# EAGLE design OpenROV Topside Interface 2.6A (EAGLE 6.4)
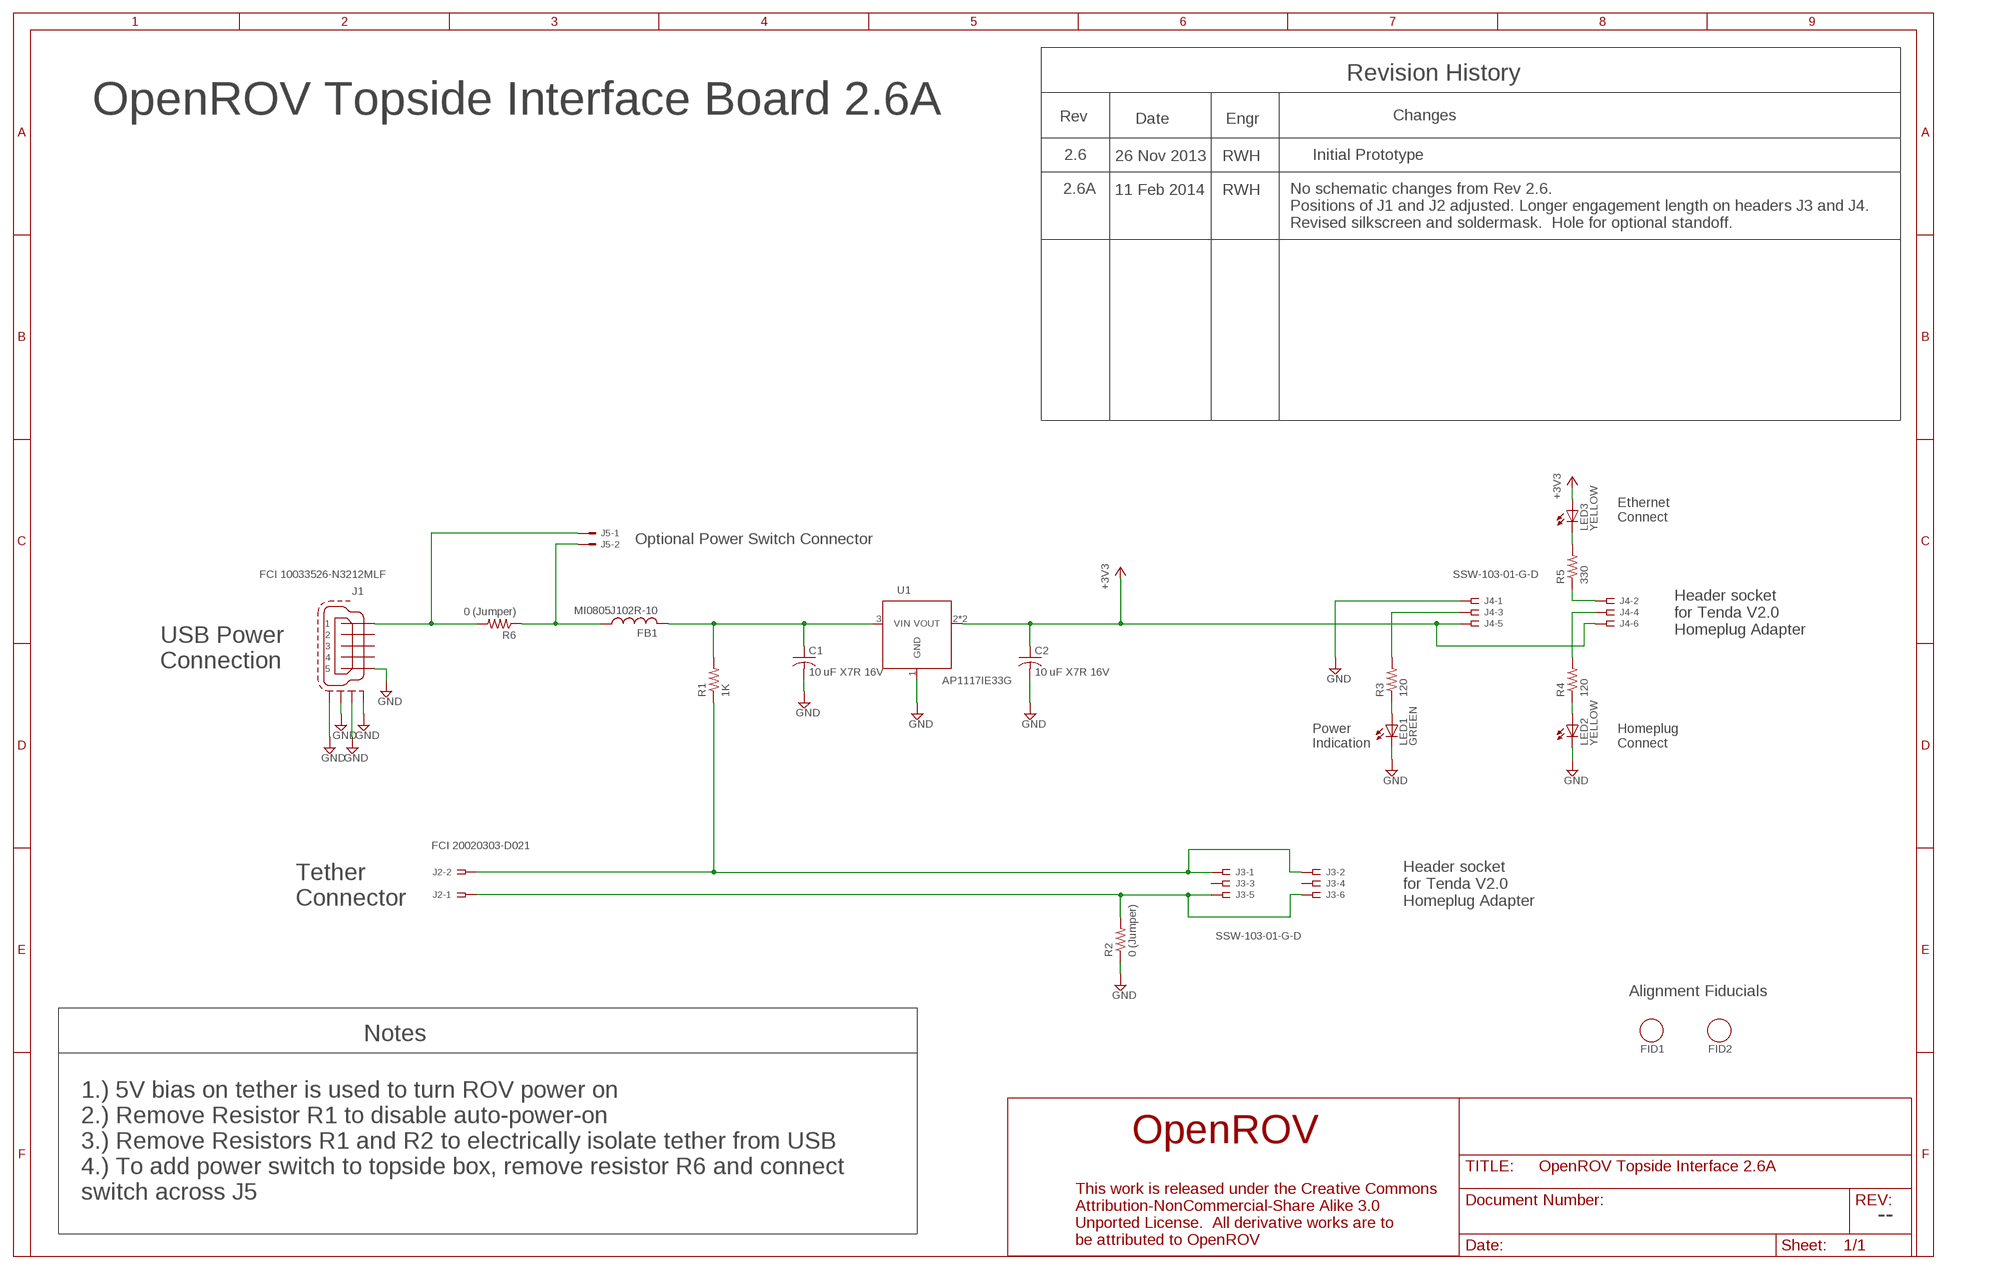
[diagram p0: schematic, sheet 1]

## Parts
C1  10 uF X7R 16V  CAP1206  [R1206]
C2  10 uF X7R 16V  CAP1206  [R1206]
FB1  MI0805J102R-10  FERRITESIZE_0805  [R0805]
FID1  FIDUCIAL_1  [FIDUCIAL_1]
FID2  FIDUCIAL_1  [FIDUCIAL_1]
J1  FCI 10033526-N3212MLF  USB_MINI-BSURFACE_MOUNT  [USB_MINI-B_SM]
J2  FCI 20020303-D021  FCI_TERMINAL_BLOCK_2PL  [FCI_09-381_2PL]
J3  SSW-103-01-G-D  HDR_SOCKET_2X3  [SSW-103-02-S-D]
J4  SSW-103-01-G-D  HDR_SOCKET_2X3  [SSW-103-02-S-D]
J5  HDR_1X2X0.100-ALT_SILK  [22-23-2021_ALT_SILK]
LED1  GREEN  LED-0805_BOTTOM_MT  [LED_0805_BOTTOM_MT(OSRAM)]
LED2  YELLOW  LED-0805_BOTTOM_MT  [LED_0805_BOTTOM_MT(OSRAM)]
LED3  YELLOW  LED-0805_BOTTOM_MT  [LED_0805_BOTTOM_MT(OSRAM)]
R1  1K  RESISTOR-0805  [R0805]
R2  0 (Jumper)  RESISTOR-0805  [R0805]
R3  120  RESISTOR-0805  [R0805]
R4  120  RESISTOR-0805  [R0805]
R5  330  RESISTOR-0805  [R0805]
R6  0 (Jumper)  RESISTOR-0805  [R0805]
U1  AP1117IE33G  AP1117SOT223  [SOT223]

## Nets
+3V3: C2.1 J4.5 J4.6 LED3.A U1.2(VOUT) U1.4(VOUT)
GND: C1.2 C2.2 J1.5 J1.M1(S1) J1.M2(S2) J1.M3(S3) J1.M4(S4) J4.1 LED1.C LED2.C R2.1 U1.1(GND)
N$1: J2.1A J2.1B J3.5 J3.6 R2.2
N$2: J2.2A J2.2B J3.1 J3.2 R1.1
N$3: J1.1 J5.1 R6.2
N$4: C1.1 FB1.2 R1.2 U1.3(VIN)
N$5: LED3.C R5.2
N$6: J4.3 R3.2
N$7: LED1.A R3.1
N$8: LED2.A R4.1
N$9: J4.4 R4.2
N$10: FB1.1 J5.2 R6.1
N$11: J4.2 R5.1
Unconnected: J1.2 J1.3 J1.4 J3.3 J3.4

## Notes on the sheet
- Revision History
- OpenROV Topside Interface Board 2.6A
- Rev | Date | Engr | Changes
- 2.6 | 26 Nov 2013 | RWH | Initial Prototype
- 2.6A | 11 Feb 2014 | RWH
- No schematic changes from Rev 2.6.
  Positions of J1 and J2 adjusted. Longer engagement length on headers J3 and J4.
  Revised silkscreen and soldermask.  Hole for optional standoff.
- Ethernet
  Connect
- Optional Power Switch Connector
- Header socket
  for Tenda V2.0
  Homeplug Adapter
- USB Power
  Connection
- Power
  Indication
- Homeplug
  Connect
- Tether
  Connector
- Header socket
  for Tenda V2.0
  Homeplug Adapter
- Alignment Fiducials
- Notes
- 1.) 5V bias on tether is used to turn ROV power on
  2.) Remove Resistor R1 to disable auto-power-on
  3.) Remove Resistors R1 and R2 to electrically isolate tether from USB
  4.) To add power switch to topside box, remove resistor R6 and connect
  switch across J5
- --

## Library data of the parts
C1 C2 = Walts_Generic_Parts:CAP: Generic Non-Polarized Capacitor
FB1 = Walts_Generic_Parts:FERRITE: Generic Surface Mount Ferrite Chip
FID1 FID2 = Walts Test Points and Pads:FIDUCIAL_1: Alignment Fiducial
J1 = OpenROV Topside Interface:USB_MINI-B: MINI USB-B Conector Adapted from Eagle Cypress connector library; OC_FARNELL: unknown; OC_NEWARK: unknown
J2 = OpenROV Topside Interface:FCI_TERMINAL_BLOCK_2PL: FCI 2-place Terminal Block 09-381 / 20020303
J3 J4 = OpenROV Topside Interface:HDR_SOCKET_2X3: 2X3 THROUGH-HOLE .025" SQ POST SOCKET Based upon Samtec SSW-103-02-S-D; MPN: SSW-103-02-S-D; OC_FARNELL: unknown; OC_NEWARK: 11P9365
J5 = Walts Generic Connectors:HDR_1X2X0.100: .100" (2.54mm) Center Header - 2 Pin Derived from Molex 22-23-2021
LED1-LED3 = Walts_Generic_Parts:LED: Generic LED
R1-R6 = Walts_Generic_Parts:RESISTOR: Generic Resistor
U1 = OpenROV Topside Interface:AP1117: Diodes, Inc. Voltage Regulator

## Board
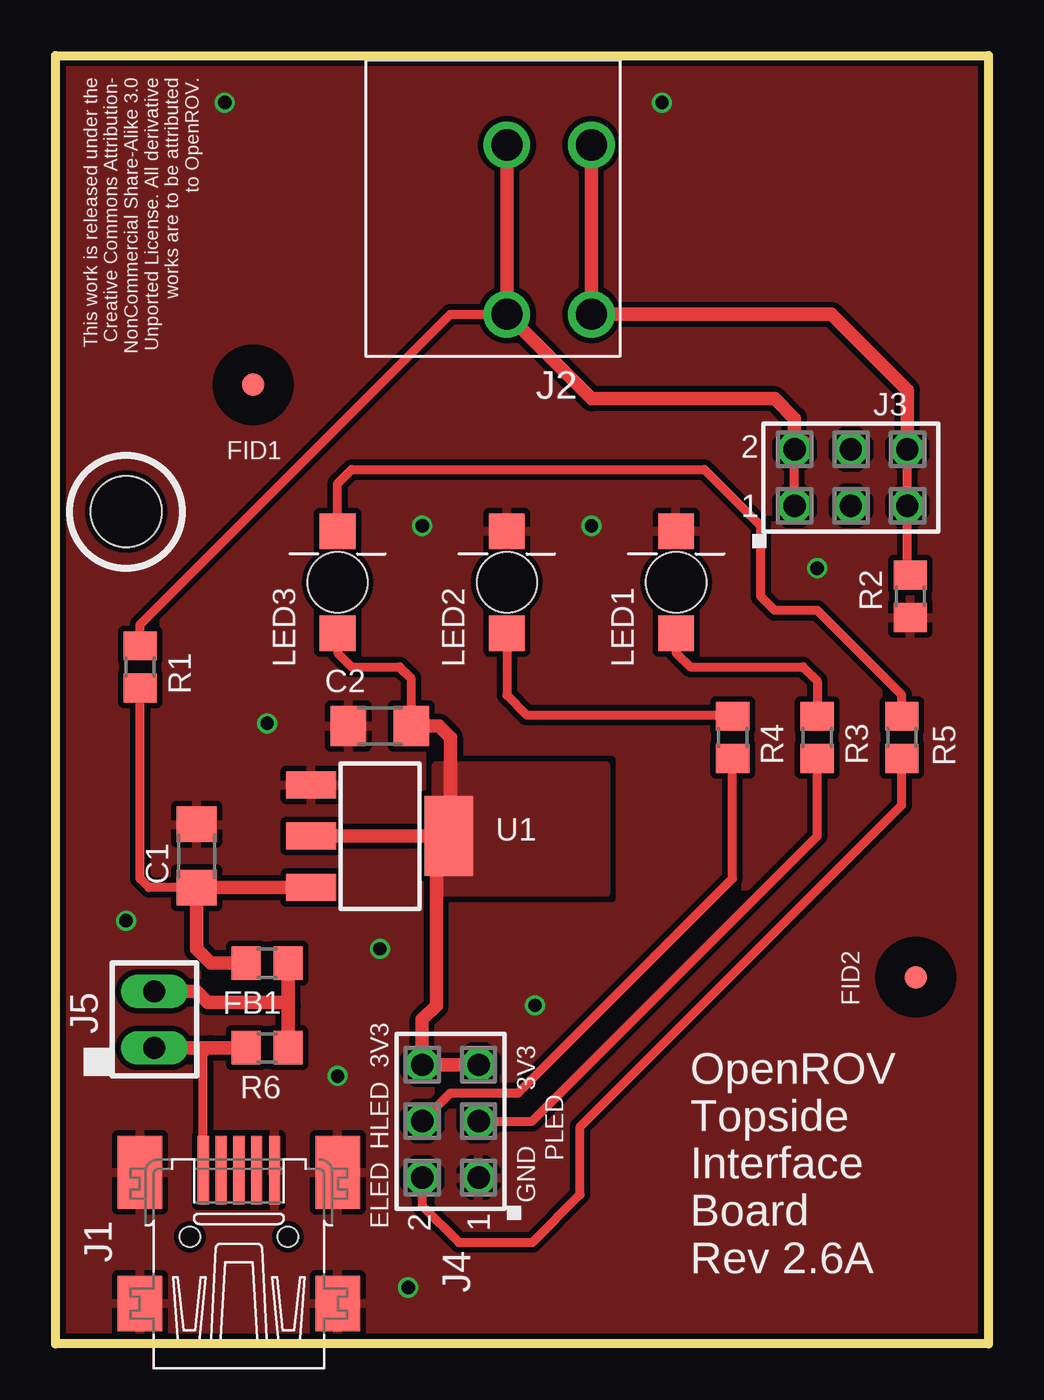
[diagram p1: board, top side]
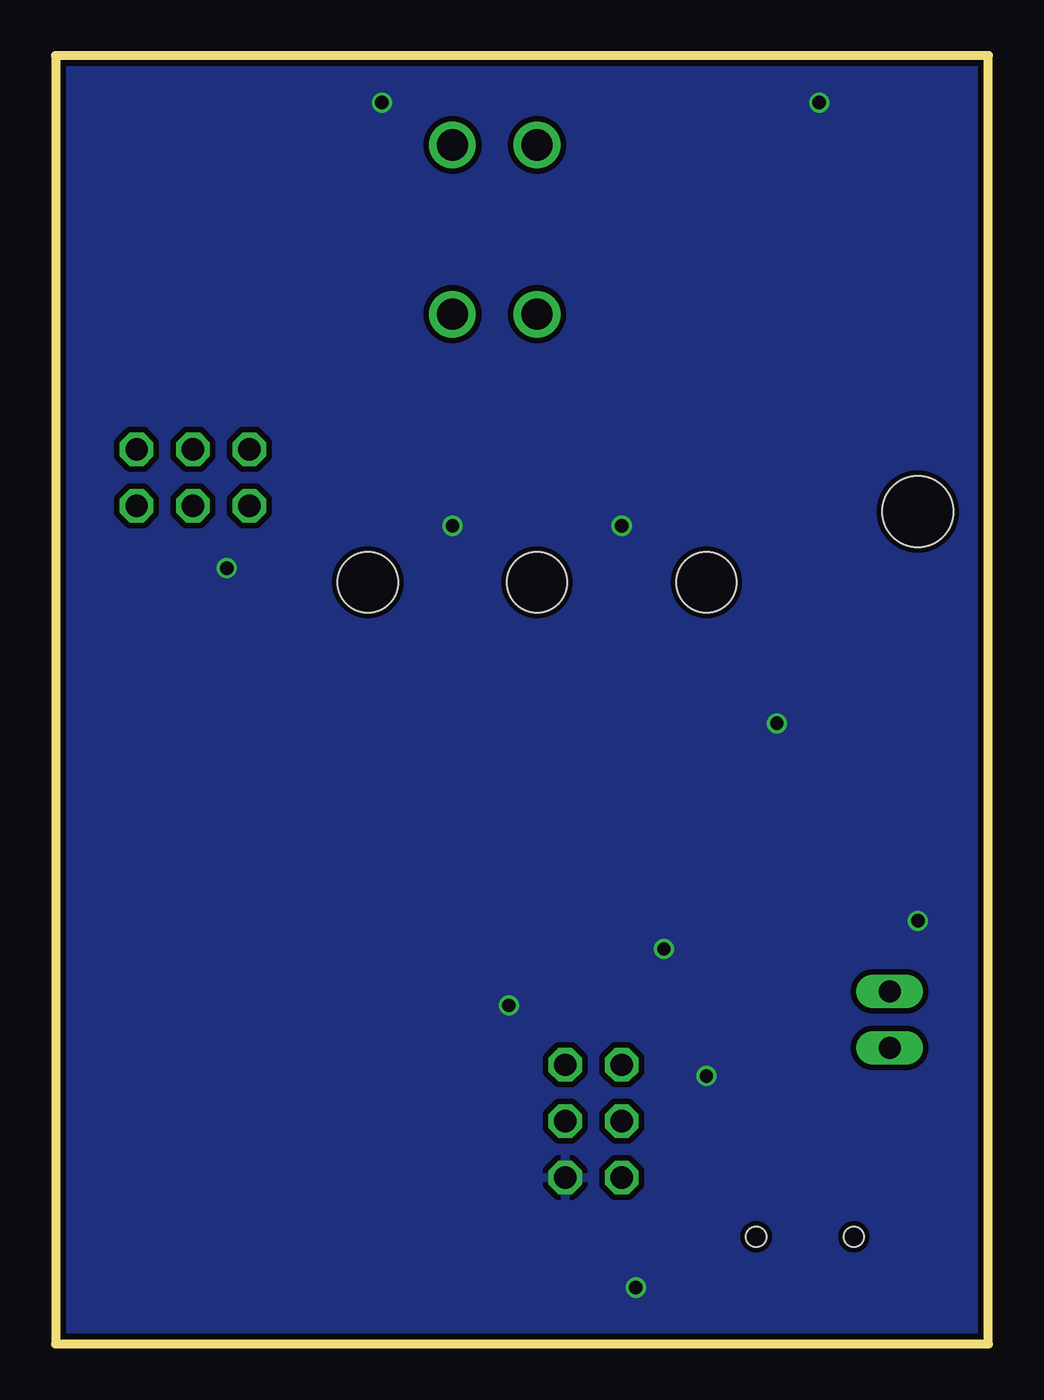
[diagram p2: board, bottom side, seen from below]

Size 42 x 58 mm. Coordinates in mm from the lower left corner, seen from the top.
Outline: 0,0 0,58 42,58 42,0 0,0
Copper layers (1*2*15*16): Top 0.035mm / dielectric 0.2mm / Route2 0.0175mm / dielectric 1.1mm / Route15 0.0175mm / dielectric 0.2mm / Bottom 0.035mm
Design rules "SeeedStudio_DRU_no_angle_20130527": minimum track width 6mil, minimum drill 12mil, track to track 6mil, track to pad 6mil, pad to pad 6mil, via to via 6mil, smd to smd 0mil, copper to edge 10mil, drill to drill 10mil, minimum pad ring 6mil, minimum via ring 6mil, stop-mask expansion 2mil, vias tented up to drill 25mil, thermal gap 10mil
Holes 3.17 mm at 3.17,37.47

### Footprints (pad centres in the part's own frame; a part is rotated, then mirrored left to right if it is on the bottom)
R1206 = smd 1.6 x 1.803: 1 -1.422,0; 2 1.422,0
R0805 = smd 1.3 x 1.5: 1 -0.95,0; 2 0.95,0
FIDUCIAL_1 = smd 1.016 x 1.016: P$1 0,0
USB_MINI-B_SM = smd 3.1 x 0.5: 1 3,1.6; 2 3,0.8; 3 3,0; 4 3,-0.8; 5 3,-1.6 | smd 2.5 x 2: M1 -3,-4.45; M2 -3,4.45 | smd 3.3 x 2: M3 2.9,4.45; M4 2.9,-4.45 | hole 0.9: 0,2.2; 0,-2.2
FCI_09-381_2PL = drill 1.4: 1A -1.905,-3.81; 1B -1.905,3.81; 2A 1.905,-3.81; 2B 1.905,3.81
SSW-103-02-S-D = drill 1 pad 1.5 octagon: 1 -2.54,-1.27; 2 -2.54,1.27; 3 0,-1.27; 4 0,1.27; 5 2.54,-1.27; 6 2.54,1.27
22-23-2021_ALT_SILK = drill 1 long: 1 -1.27,0; 2 1.27,0
LED_0805_BOTTOM_MT(OSRAM) = smd 1.6 x 1.6: A -2.3,0; C 2.3,0 | hole 2.7: 0,0
SOT223 = smd 1.219 x 2.235: 1 -2.311,-3.099; 2 0,-3.099; 3 2.311,-3.099 | smd 3.6 x 2.2: 4 0,3.099

### Placement (x,y rotation side)
C1  6.35,21.97 90 top
C2  14.61,27.81 180 top
FB1  9.53,17.14 180 top
FID1  8.89,43.18 90 top
FID2  38.73,16.51 0 top
J1  8.26,4.83 90 top
J2  22.23,50.16 180 top
J3  35.81,39 0 top
J4  17.78,10.03 90 top
J5  4.45,14.61 90 top
LED1  27.94,34.29 90 top
LED2  20.32,34.29 90 top
LED3  12.7,34.29 90 top
R1  3.81,30.48 270 top
R2  38.48,33.66 90 top
R3  34.29,27.3 270 top
R4  30.48,27.3 270 top
R5  38.1,27.3 90 top
R6  9.53,13.34 180 top
U1  14.61,22.86 270 top

### Tracks (layer width: path | path; a pad name or v marks a point on that pad's centre or on a via)
+3V3
  Top 0.406: LED3.A 12.7,31.11 13.34,30.48 15.49,30.48 16,29.97 16,27.84 C2.1
  Top 0.61: 17.55,22.71 U1.4 | U1.2 17.14,22.86 | 17.14,22.86 U1.4 | C2.1 17.27,27.81 17.78,27.3 17.78,22.94 U1.4 | 17.14,22.86 17.14,15.24 16.51,14.61 J4.6 J4.5
  pour Top: 24.77,26.04 24.77,20.32 17.14,20.32 17.14,26.04
GND  (via drill 0.6)
  other vias: 12.7,12.06 15.88,2.54 21.59,15.24 24.13,36.83 16.51,36.83 9.53,27.94 14.61,17.78 34.29,34.92 27.3,55.88 7.62,55.88 3.17,19.05
  pour Bottom (isolate 0.254): 0,0 0,57.78 41.91,57.78 41.91,0
  pour Top (isolate 0.254, rank 2): 0,57.78 41.91,57.78 41.91,0 0,0
N$1
  Top 0.406: J3.6 J3.5 38.35,34.6 R2.2
  Top 0.61: J2.1A J2.1B 34.92,46.35 38.35,42.93 J3.6
N$2
  Top 0.406: R1.1 3.81,32.38 17.78,46.35 J2.2B | J3.1 J3.2
  Top 0.61: J2.2A J2.2B 24.13,42.55 32.38,42.55 33.27,41.66 J3.2 33.69,40.6
N$3
  Top 0.406: J1.1 6.66,13.01 6.99,13.34
  Top 0.61: J5.1 6.99,13.34 R6.2
N$4
  Top 0.406: C1.1 4.22,20.55 3.81,20.95 R1.2
  Top 0.61: U1.3 C1.1 6.35,17.78 6.99,17.14 FB1.2
N$5
  Top 0.406: LED3.C 12.7,38.73 13.34,39.37 29.21,39.37 31.75,36.83 31.75,33.66 32.38,33.02 34.29,33.02 38.1,29.21 R5.2
N$6
  Top 0.406: J4.3 21.46,10.03 34.29,22.86 R3.2
N$7
  Top 0.406: LED1.A 27.94,31.11 28.57,30.48 33.66,30.48 34.29,29.84 R3.1
N$8
  Top 0.406: LED2.A 20.32,29.21 21.21,28.32 30.41,28.32 R4.1
N$9
  Top 0.406: J4.4 17.78,11.3 20.83,11.3 30.48,20.95 R4.2
N$10
  Top 0.61: R6.1 10.47,15.24 | 10.47,15.24 FB1.1 | J5.2 6.35,15.88 6.86,15.37 10.35,15.37 10.47,15.24
N$11
  Top 0.406: J4.2 16.51,6.22 18.16,4.57 21.46,4.57 23.62,6.73 23.62,9.78 38.1,24.26 R5.1

### Text on the board
tPlace: This work is released under the / Creative Commons Attribution- / NonCommercial Share-Alike 3.0 / Unported License. All derivative / works are to be attributed / to OpenROV. | 3V3 | 3V3 | HLED | PLED | GND | ELED | OpenROV / Topside / Interface / Board / Rev 2.6A
bStop: Ethernet / Connect | Power | HomePlug / Connect | OpenROV / Topside / Interface / Board / Rev 2.6A